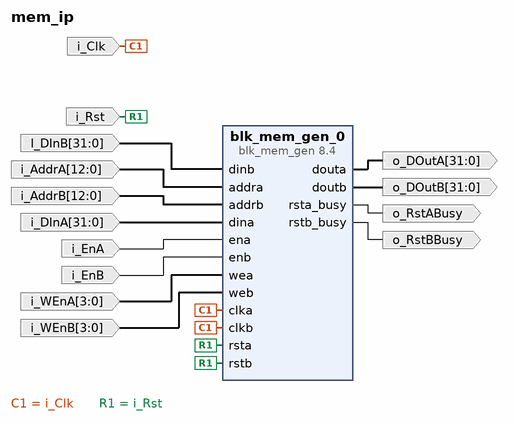
[diagram p0: block diagram of the top level]
# Vivado block design mem_ip, xc7z010clg400-1, Vivado 2023.1
create_bd_design mem_ip

create_bd_port -dir I -type rst i_Rst
set_property -dict {CONFIG.POLARITY ACTIVE_HIGH} [get_bd_ports i_Rst]
create_bd_port -dir I -from 12 -to 0 i_AddrA
create_bd_port -dir I -type clk i_Clk
set_property -dict {CONFIG.FREQ_HZ 125000000} [get_bd_ports i_Clk]
create_bd_port -dir I -from 31 -to 0 i_DInA
create_bd_port -dir I i_EnA
create_bd_port -dir I -from 3 -to 0 i_WEnA
create_bd_port -dir I -from 12 -to 0 i_AddrB
create_bd_port -dir I -from 31 -to 0 I_DInB
create_bd_port -dir I i_EnB
create_bd_port -dir I -from 3 -to 0 i_WEnB
create_bd_port -dir O -from 31 -to 0 o_DOutA
create_bd_port -dir O -from 31 -to 0 o_DOutB
create_bd_port -dir O o_RstABusy
create_bd_port -dir O o_RstBBusy

create_bd_cell -type ip -vlnv xilinx.com:ip:blk_mem_gen:8.4 blk_mem_gen_0
set_property -dict [list \
  CONFIG.Assume_Synchronous_Clk false \
  CONFIG.Byte_Size 8 \
  CONFIG.Coe_File ../../../../../../../../mem_ip_blk_mem_gen_0_0.coe \
  CONFIG.Load_Init_File true \
  CONFIG.Memory_Type True_Dual_Port_RAM \
  CONFIG.Register_PortA_Output_of_Memory_Primitives false \
  CONFIG.Register_PortB_Output_of_Memory_Primitives false \
  CONFIG.Use_Byte_Write_Enable true \
  CONFIG.Use_RSTA_Pin true \
  CONFIG.Use_RSTB_Pin true \
  CONFIG.Write_Width_A 32 \
  CONFIG.use_bram_block Stand_Alone \
] [get_bd_cells blk_mem_gen_0]

# ---- connections ----

connect_bd_net [get_bd_ports I_DInB] [get_bd_pins blk_mem_gen_0/dinb]
connect_bd_net [get_bd_pins blk_mem_gen_0/douta] [get_bd_ports o_DOutA]
connect_bd_net [get_bd_pins blk_mem_gen_0/doutb] [get_bd_ports o_DOutB]
connect_bd_net [get_bd_pins blk_mem_gen_0/rsta_busy] [get_bd_ports o_RstABusy]
connect_bd_net [get_bd_pins blk_mem_gen_0/rstb_busy] [get_bd_ports o_RstBBusy]
connect_bd_net [get_bd_ports i_AddrA] [get_bd_pins blk_mem_gen_0/addra]
connect_bd_net [get_bd_ports i_AddrB] [get_bd_pins blk_mem_gen_0/addrb]
connect_bd_net [get_bd_ports i_Clk] [get_bd_pins blk_mem_gen_0/clka] [get_bd_pins blk_mem_gen_0/clkb]
connect_bd_net [get_bd_ports i_DInA] [get_bd_pins blk_mem_gen_0/dina]
connect_bd_net [get_bd_ports i_EnA] [get_bd_pins blk_mem_gen_0/ena]
connect_bd_net [get_bd_ports i_EnB] [get_bd_pins blk_mem_gen_0/enb]
connect_bd_net [get_bd_ports i_Rst] [get_bd_pins blk_mem_gen_0/rsta] [get_bd_pins blk_mem_gen_0/rstb]
connect_bd_net [get_bd_ports i_WEnA] [get_bd_pins blk_mem_gen_0/wea]
connect_bd_net [get_bd_ports i_WEnB] [get_bd_pins blk_mem_gen_0/web]

validate_bd_design
save_bd_design
